# EAGLE design cooldrv (EAGLE 6.6.0)
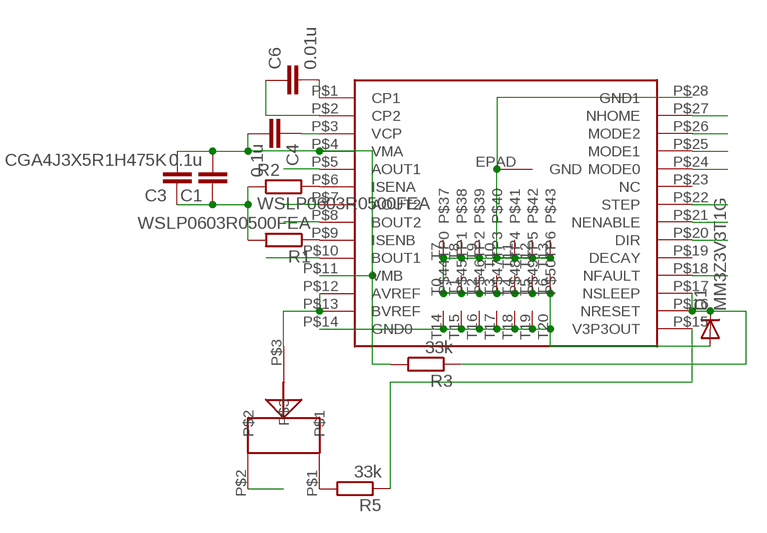
[diagram p0: schematic, sheet 1]

## Parts
C1  0.1u  C-EUC0603  [C0603]
C3  CGA4J3X5R1H475K  C-EUC0805K  [C0805K]
C4  0.1u  C-EUC0603K  [C0603K]
C6  0.01u  C-EUC0603  [C0603]
D1  MM3Z3V3T1G  DIODE-SOD323-R  [SOD323-R]
R1  WSLP0603R0500FEA  0805CS  [0805C]
R2  WSLP0603R0500FEA  0805CS  [0805C]
R3  33k  R-EU_R0603  [R0603]
R5  33k  R-EU_R0603  [R0603]
U$1  DRV8825  [ETSSOP28]
U$2  EVM-3YSX50B14  TRIMMER3MM  [TRIMMER3MM]

## Nets
A1: U$1.P$5(AOUT1)
A2: U$1.P$7(AOUT2)
B1: U$1.P$10(BOUT1)
B2: U$1.P$8(BOUT2)
DIR: U$1.P$20(DIR)
EN: U$1.P$21(NENABLE)
FAULT: U$1.P$18(NFAULT)
GND: C1.1 C3.1 D1.A R1.2 R2.1 U$1.EPAD(GND) U$1.P$14(GND0) U$1.P$28(GND1) U$1.T0(TP0) U$1.T1(TP1) U$1.T2(TP2) U$1.T3(TP3) U$1.T4(TP4) U$1.T5(TP5) U$1.T6(TP6) U$1.T7 U$1.T8 U$1.T9 U$1.T10 U$1.T11 U$1.T12 U$1.T13 U$1.T14 U$1.T15 U$1.T16 U$1.T17 U$1.T18 U$1.T19 U$1.T20 U$2.P$2
HOME: U$1.P$27(NHOME)
MS1: U$1.P$24(MODE0)
MS2: U$1.P$25(MODE1)
MS3: U$1.P$26(MODE2)
N$1: D1.C R3.1 U$1.P$16(NRESET) U$1.P$17(NSLEEP)
N$3: R2.2 U$1.P$6(ISENA)
N$4: R1.1 U$1.P$9(ISENB)
N$6: C6.2 U$1.P$1(CP1)
N$7: C6.1 U$1.P$2(CP2)
N$8: C4.1 U$1.P$3(VCP)
N$11: R5.2 U$2.P$1
N$12: R5.1 U$1.P$15(V3P3OUT)
REF: U$1.P$12(AVREF) U$1.P$13(BVREF) U$2.P$3
STEP: U$1.P$22(STEP)
VMOT: C1.2 C3.2 C4.2 R3.2 U$1.P$4(VMA) U$1.P$11(VMB)
Unconnected: U$1.P$19(DECAY) U$1.P$23(NC)

## Library data of the parts
C1 C3 C4 C6 = rcl:C-EU: CAPACITOR, European symbol
D1 = diode:DIODE-: DIODE
R1 R2 = untitled:0805CS
R3 R5 = rcl:R-EU_: RESISTOR, European symbol
U$1 = untitled:DRV8825
U$2 = untitled:TRIMMER3MM

## Board
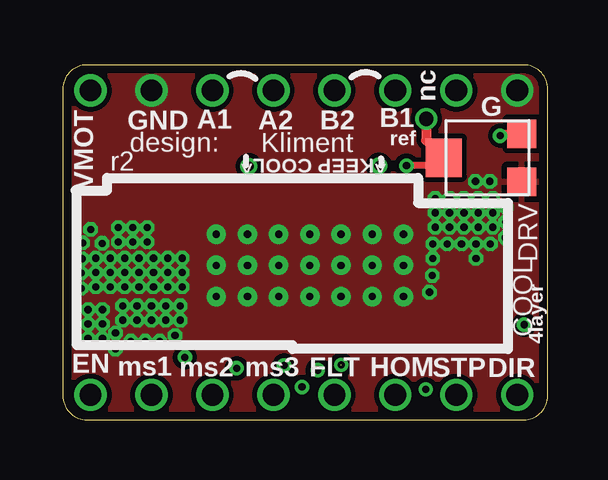
[diagram p1: board, top side]
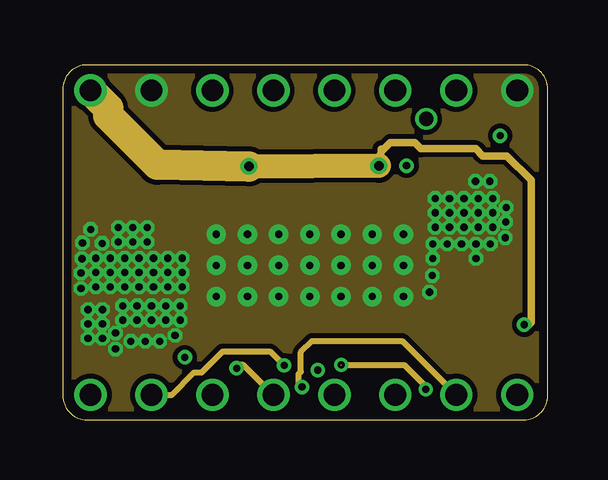
[diagram p2: board, inner layer Route2]
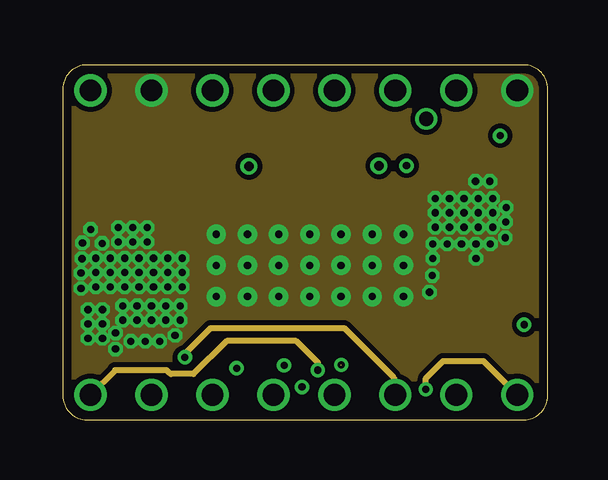
[diagram p3: board, inner layer Route15]
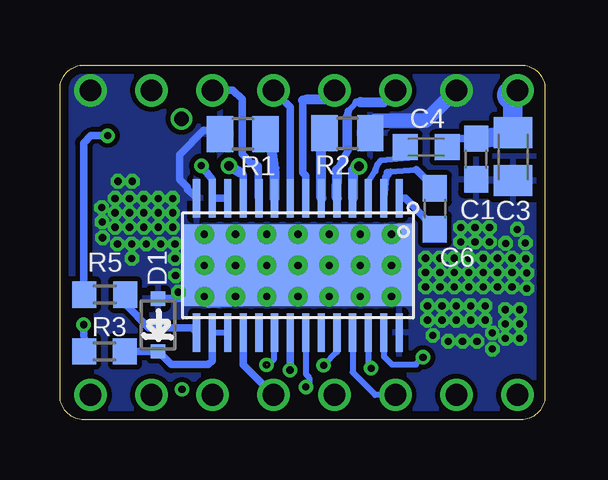
[diagram p4: board, bottom side, seen from below]

Size 20.2 x 14.8 mm. Coordinates in mm from the lower left corner, seen from the top.
Outline: 19.2,0 arc90 20.2,1 20.2,13.8 arc90 19.2,14.8 1,14.8 arc90 0,13.8 0,1 arc90 1,0 19.2,0
Copper layers (1+2*15+16): Top 0.035mm / dielectric 0.2mm / Route2 0.035mm / dielectric 1.5mm / Route15 0.035mm / dielectric 0.2mm / Bottom 0.035mm
Design rules "default": minimum track width 8mil, minimum drill 0.3mm, track to track 8mil, track to pad 8mil, pad to pad 8mil, via to via 8mil, smd to smd 0mil, copper to edge 0.35mm, drill to drill 8mil, minimum pad ring 10mil, minimum via ring 0.15mm, stop-mask expansion 2mil, vias tented up to drill 20mil, thermal gap 10mil

### Footprints (pad centres in the part's own frame; a part is rotated, then mirrored left to right if it is on the bottom)
C0603 = smd 1.1 x 1: 1 -0.85,0; 2 0.85,0
C0805K = smd 1.3 x 1.6: 1 -1,0; 2 1,0
C0603K = smd 1.05 x 1.08: 1 -0.875,0; 2 0.875,0
SOD323-R = smd 0.6 x 0.6: A 1.1,0; C -1.1,0
0805C = smd 1.1 x 1.5: 1 -0.95,0; 2 0.95,0
R0603 = smd 1 x 1.1: 1 -0.85,0; 2 0.85,0
ETSSOP28 = smd 3.4 x 9.7: EPAD 0,0 | smd 1.6 x 0.3: P$1 -2.8,4.225; P$2 -2.8,3.575; P$3 -2.8,2.925; P$4 -2.8,2.275; P$5 -2.8,1.625; P$6 -2.8,0.975; P$7 -2.8,0.325; P$8 -2.8,-0.325; P$9 -2.8,-0.975; P$10 -2.8,-1.625; P$11 -2.8,-2.275; P$12 -2.8,-2.925; P$13 -2.8,-3.575; P$14 -2.8,-4.225; P$15 2.8,-4.225; P$16 2.8,-3.575; P$17 2.8,-2.925; P$18 2.8,-2.275; P$19 2.8,-1.625; P$20 2.8,-0.975; P$21 2.8,-0.325; P$22 2.8,0.325; P$23 2.8,0.975; P$24 2.8,1.625; P$25 2.8,2.275; P$26 2.8,2.925; P$27 2.8,3.575; P$28 2.8,4.225 | drill 0.3 pad 0.61: T0 -1.3,3.9; T1 0,3.9; T2 1.3,3.9; T3 -1.3,2.6; T4 0,2.6; T5 1.3,2.6; T6 -1.3,1.3; T7 0,1.3; T8 1.3,1.3; T9 -1.3,0; T10 0,0; T11 1.3,0; T12 -1.3,-1.3; T13 0,-1.3; T14 1.3,-1.3; T15 -1.3,-2.6; T16 0,-2.6; T17 1.3,-2.6; T18 -1.3,-3.9; T19 0,-3.9; T20 1.3,-3.9
TRIMMER3MM = smd 1.2 x 1.2: P$1 1,-1.6; P$2 -1,-1.6 | smd 1.6 x 1.5: P$3 0,1.65

### Placement (x,y rotation side)
C1  2.87,10.88 90 bottom
C3  1.33,10.97 90 bottom
C4  4.95,11.37 0 bottom
C6  4.58,8.8 270 bottom
D1  16.12,3.95 90 bottom
R1  12.59,11.92 180 bottom
R2  8.23,11.96 180 bottom
R3  18.35,2.85 180 bottom
R5  18.34,5.22 180 bottom
U$1  10.29,6.44 270 bottom
U$2  17.52,10.93 90 top

### Tracks (layer width: path | path; a pad name or v marks a point on that pad's centre or on a via)
A1  (via drill 0.9)
  Bottom 0.254: 8.19,12.87 7.85,13.24
  Bottom 0.305: 8.66,10.43 8.2,11.24 8.23,11.42 | 8.23,12.63 8.19,12.87 | 7.85,13.24 7.68,13.24 | 6.72,13.24 v6.23,13.74
  Bottom 0.39: 8.23,11.42 8.23,12.63
  Bottom 0.406: U$1.P$5 8.66,10.43 | 7.68,13.24 7.68,13.25 6.72,13.24
A2  (via drill 0.9)
  Bottom 0.254: 9.04,13.37 v8.77,13.74
  Bottom 0.305: 10.09,13.31 10.09,10.32 9.96,10.19 U$1.P$7
  Bottom 0.406: 10.09,13.31 9.9,13.37 9.04,13.37
B1  (via drill 0.9)
  Bottom 0.305: v13.85,13.74 13.01,13.74 12.62,13.37 12.62,11.07 12.26,10.71 12.09,10.69 11.94,10.59 11.94,9.26 U$1.P$10
B2  (via drill 0.9)
  Bottom 0.305: U$1.P$8 10.62,13.04 v11.31,13.74
DIR  (via drill 0.3, 0.9)  (1 unrouted)
  Route2 0.254: 11.58,2.29 14.22,2.29 15.04,1.47 15.04,1.35 v15.12,1.27
  Route15 0.254: v15.12,1.27 15.12,1.73 15.84,2.45 17.52,2.45 v18.93,1.04
  Bottom 0.254: v11.6,2.29 11.52,2.29 11.28,2.53 11.28,3.62 U$1.P$20
EN  (via drill 0.3, 0.9)
  Route15 0.254: v10.62,2.07 10.62,2.39 9.72,3.29 6.82,3.29 5.44,1.91 4.5,1.91 4.42,1.97 4.32,2.07 2.18,2.07 v1.15,1.04
  Bottom 0.305: v10.62,2.07 U$1.P$21
FAULT  (via drill 0.9)
  Bottom 0.305: U$1.P$18 12.57,2.29 v11.31,1.04
GND  (via drill 0.3, 0.9)
  Bottom 0.305: 5.56,8.06 U$1.T18 U$1.T15 U$1.T12 | U$1.T2 14.02,4.81 | U$1.T2 U$1.T1 U$1.T0 U$1.T3 U$1.T4 | U$1.T2 U$1.T5 U$1.T8 U$1.T11 U$1.EPAD | U$1.EPAD U$1.T9 U$1.T12 | U$1.EPAD U$1.T7 9,7.67 8.99,7.68 U$1.T6 | U$1.T13 U$1.EPAD | U$1.T12 U$1.T13 | U$1.T13 11.6,6.42 U$1.T14 U$1.T17 U$1.T20 14.28,5.05 D1.A | U$1.T19 U$1.T16 U$1.T13 | R1.2 14.21,12.08 15.22,11.07 15.22,10.03 14.9,9.71 14.9,9.62 U$1.P$14
  Bottom 0.61: R2.1 7.22,12.33 7.08,12.47 4.96,12.47 v3.69,13.74
  other vias: 1.38,5.54 1.38,6.14 1.98,5.54 1.98,6.14 2.57,5.54 2.57,6.14 3.17,6.14 3.17,5.54 3.77,5.54 3.77,6.14 4.38,5.54 4.38,6.14 4.97,5.54 4.97,6.14 15.51,9.23 16.11,9.23 15.51,8.63 16.11,8.63 16.11,8.04 15.51,8.04 17.79,9.95 16.71,8.04 16.71,8.63 16.71,9.23 4.97,6.74 4.38,6.74 3.77,6.74 3.17,6.74 2.57,6.74 1.98,6.74 1.38,6.74 1.05,4.59 1.65,4.59 1.05,3.99 1.65,3.99 1.05,3.4 1.65,3.4 3.09,4.75 2.49,4.75 2.49,4.15 3.09,4.15 15.41,7.33 16.01,7.33 15.41,6.73 18.43,7.59 17.31,9.23 17.91,9.23 17.31,8.63 17.91,8.63 17.91,8.04 17.31,8.04 0.76,5.48 2.19,3.62 0.82,7.38 18.45,8.25 16.61,7.33 3.69,4.15 3.69,4.75 2.31,7.41 2.31,8.01 2.91,8.01 2.91,7.41 4.29,4.75 4.29,4.15 17.21,7.33 17.21,6.73 1.15,7.94 15.28,5.32 0.76,6.12 0.8,6.72 4.67,3.52 1.63,7.36 2.19,2.96 17.81,7.33 4.89,4.15 4.89,4.75 3.51,7.41 3.51,8.01 17.19,9.95 15.39,6.01 18.47,8.86 2.83,3.27 3.43,3.27 4.03,3.27 18.93,13.74
  pour Bottom: -0.3,15.99 21.26,15.99 21.32,-2.79 -2.2,-2.79 -2.26,15.13
  pour Route15: -1.3,16.47 21.36,16.47 21.56,-2.51 -2.28,-2.45 -2.48,15.27
  pour Route2: -2.34,17.05 21.04,17.05 21.04,-2.19 -6.54,-2.15 -6.54,15.59
  pour Top: -1.48,18.41 22.62,18.41 21.1,-2.19 -4.72,-2.19 -4.72,15.07
HOME  (via drill 0.3, 0.9)
  Route15 0.254: v5.08,2.61 5.08,2.75 6.16,3.83 11.72,3.83 13.78,1.77 13.78,1.11 v13.85,1.04
  Bottom 0.254: U$1.P$27 6.71,2.65 6.38,2.31 5.38,2.31 v5.08,2.61
MS1  (via drill 0.3, 0.9)
  Route2 0.254: v3.69,1.04 4.53,1.04 5.46,1.97 5.78,1.97 6.66,2.85 8.64,2.85 v9.22,2.27
  Bottom 0.254: U$1.P$24 8.67,2.83 v9.22,2.27
MS2  (via drill 0.9)
  Bottom 0.254: U$1.P$25 8.02,1.98 7.07,1.04 v6.23,1.04
MS3  (via drill 0.3, 0.9)
  Route2 0.254: v8.77,1.04 7.52,2.29 7.38,2.29 v7.24,2.15
  Bottom 0.254: U$1.P$26 7.37,2.27 v7.24,2.15
N$1
  Bottom 0.254: U$1.P$16 U$1.P$17
  Bottom 0.305: U$1.P$16 13.87,2.46 14.02,2.31 15.58,2.31 D1.C R3.1
N$3
  Bottom 0.254: 9.32,11.88 R2.2
  Bottom 0.406: U$1.P$6 9.32,11.88
N$4
  Bottom 0.254: R1.1 11.37,11.83
  Bottom 0.406: U$1.P$9 11.27,10.29 11.28,10.49 11.48,11.92 R1.1
N$6
  Bottom 0.305: U$1.P$1 5.83,9.24 4.98,8.39 4.98,8.34 C6.2
N$7
  Bottom 0.254: 6.56,10.31 6.44,10.36 5.37,10.43
  Bottom 0.305: U$1.P$2 6.63,10.12 6.48,10.31 6.56,10.31 | 5.37,10.43 C6.1
N$8
  Bottom 0.254: U$1.P$3 7.34,9.96 7.06,10.37 6.96,10.67 6.83,10.83 5.68,10.93 5.58,11.03
  Bottom 0.305: 5.58,11.03 5.58,11.12 C4.1
N$11  (via drill 0.3)
  Top 0.305: U$2.P$1 18.3,11.93 v18.22,11.85
  Bottom 0.305: v18.22,11.85 18.92,11.85 19.22,11.55 19.22,5.25 R5.2
N$12
  Bottom 0.305: U$1.P$15 14.71,3.83 16.5,3.83 17.49,4.82 R5.1
NC  (via drill 0.9)
  other vias: 16.39,13.74
REF  (via drill 0.3, 0.6)
  Top 0.305: v14.32,10.6 15.57,10.63 U$2.P$3
  Top 0.406: v15.14,12.55 15.14,11.66 U$2.P$3
  Bottom 0.305: U$1.P$12 U$1.P$13 13.87,10.01 v14.32,10.6
STEP  (via drill 0.3, 0.9)
  Route2 0.254: v9.96,1.37 9.96,1.41 9.82,1.55 9.82,1.91 9.92,2.01 9.92,2.83 10.38,3.29 14.14,3.29 v16.39,1.04
  Bottom 0.254: U$1.P$22 9.97,1.92 9.82,1.77 9.82,1.51 v9.96,1.37
VMOT  (via drill 0.3, 0.4, 0.9)
  Route2 0.305: v19.22,3.97 19.28,3.83 19.52,4.07 19.52,9.99 18.5,11.01 17.5,11.01 17.2,11.31 14.92,11.31 14.66,11.57 13.65,11.57 13.27,11.19 | v13.17,10.59 13.27,11.19 | 13.27,11.19 13.27,11.29
  Route2 1.016: v13.17,10.59 v7.75,10.57
  Route2 1.27: v7.75,10.57 3.92,10.64 1.88,12.69 1.88,13.01 v1.15,13.74
  Bottom 0.254: 8,9.25 U$1.P$4 | 0.83,13.42 v1.15,13.74
  Bottom 0.305: U$1.P$11 12.57,10.21 12.67,10.31 | C1.2 3.71,11.73 C4.2 | R3.2 19.2,2.95 v19.22,3.97
  Bottom 0.406: v13.17,10.59 12.67,10.31 | v7.75,10.57 8,10.42 8,9.25
  Bottom 0.813: C1.2 1.15,11.86 C3.2 1.35,13.54
  Bottom 1.27: 1.35,13.54 v1.15,13.74

### Text on the board
tPlace: nc | G | VMOT | GND | A1 | A2 | B2 | B1 | ref | design: | r2 | Kliment | ^KEEP COOL!^ | DRV | COOL | 4layer | EN | ms1 | ms3 | STP | DIR | ms2 | FLT | HOM